# Altium schematic sheet ecternal_i2c.SchDoc
size A4; SheetNumber: 11; SheetTotal: 13
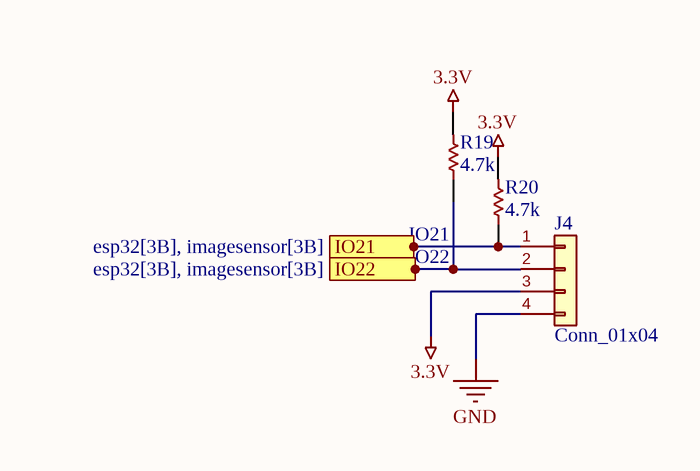
[diagram p0: ecternal_i2c.SchDoc]

## Parts
J4  Conn_01x04  [connector 4pin]
R19  4.7k  [RESC2013X70X40NL20T20]
R20  4.7k  [RESC2013X70X40NL20T20]

## Ports
IO21 (see esp32[3B], imagesensor[3B]), IO22 (see esp32[3B], imagesensor[3B])

## Nets
3.3V: J4.3(Pin_3) R19.2 R20.2
GND: J4.4(Pin_4)
IO21: J4.1(Pin_1) R20.1 ; port IO21
IO22: J4.2(Pin_2) R19.1 ; port IO22

## Notes on the sheet
- IO21
- IO22

## Library data of the parts
R19 R20 = CMP-2100-03671-1: Chip Resistor, 1 KOhm, +/- 1%, 125 mW, -55 to 155 degC, 0805 (2012 Metric), RoHS, Tape and Reel; Manufacturer: Yageo; Temperature Coefficient: 100ppm/degreesC; Voltage Rating (DC): 150V; Max Power Dissipation: 125mW; Resistance: 1KOhm; Number of Pins: 2; Number of Terminations: 2; Datasheet URL: http://www.yageo.com/NewPortal/yageodocoutput?fileName=/pdf/R-Chip/PYu-RC_Group_51_RoHS_L_5.pdf; Length: 0.079inch; Package Description: 2-Pin Surface Mounted Device, Body 2 x 1.25 mm; Depth: 1.25mm; Height: 0.024inch; Military Standard: Not; Case/Package: 0805; Package Reference: 0805; RoHSCompliant: true; Lead Free: LeadFree; Packaging: TapeandReel; Package Quantity: 1; Datasheet Version: Rev. 5, 10/2016; Tolerance: 1%; Min Operating Temperature: -55degC; Voltage Rating: 150V; Composition: ThickFilm; Case Code (Imperial): 0805; Power Rating: 125mW; Width: 0.049inch; Case Code (Metric): 2012; Manufacturer URL: http://www.yageo.com/; Max Operating Temperature: 155degC; REACH SVHC: Unknown; Termination: SMD/SMT